# Altium schematic sheet 08-Power.SchDoc
size B; SheetNumber: 8; SheetTotal: 11
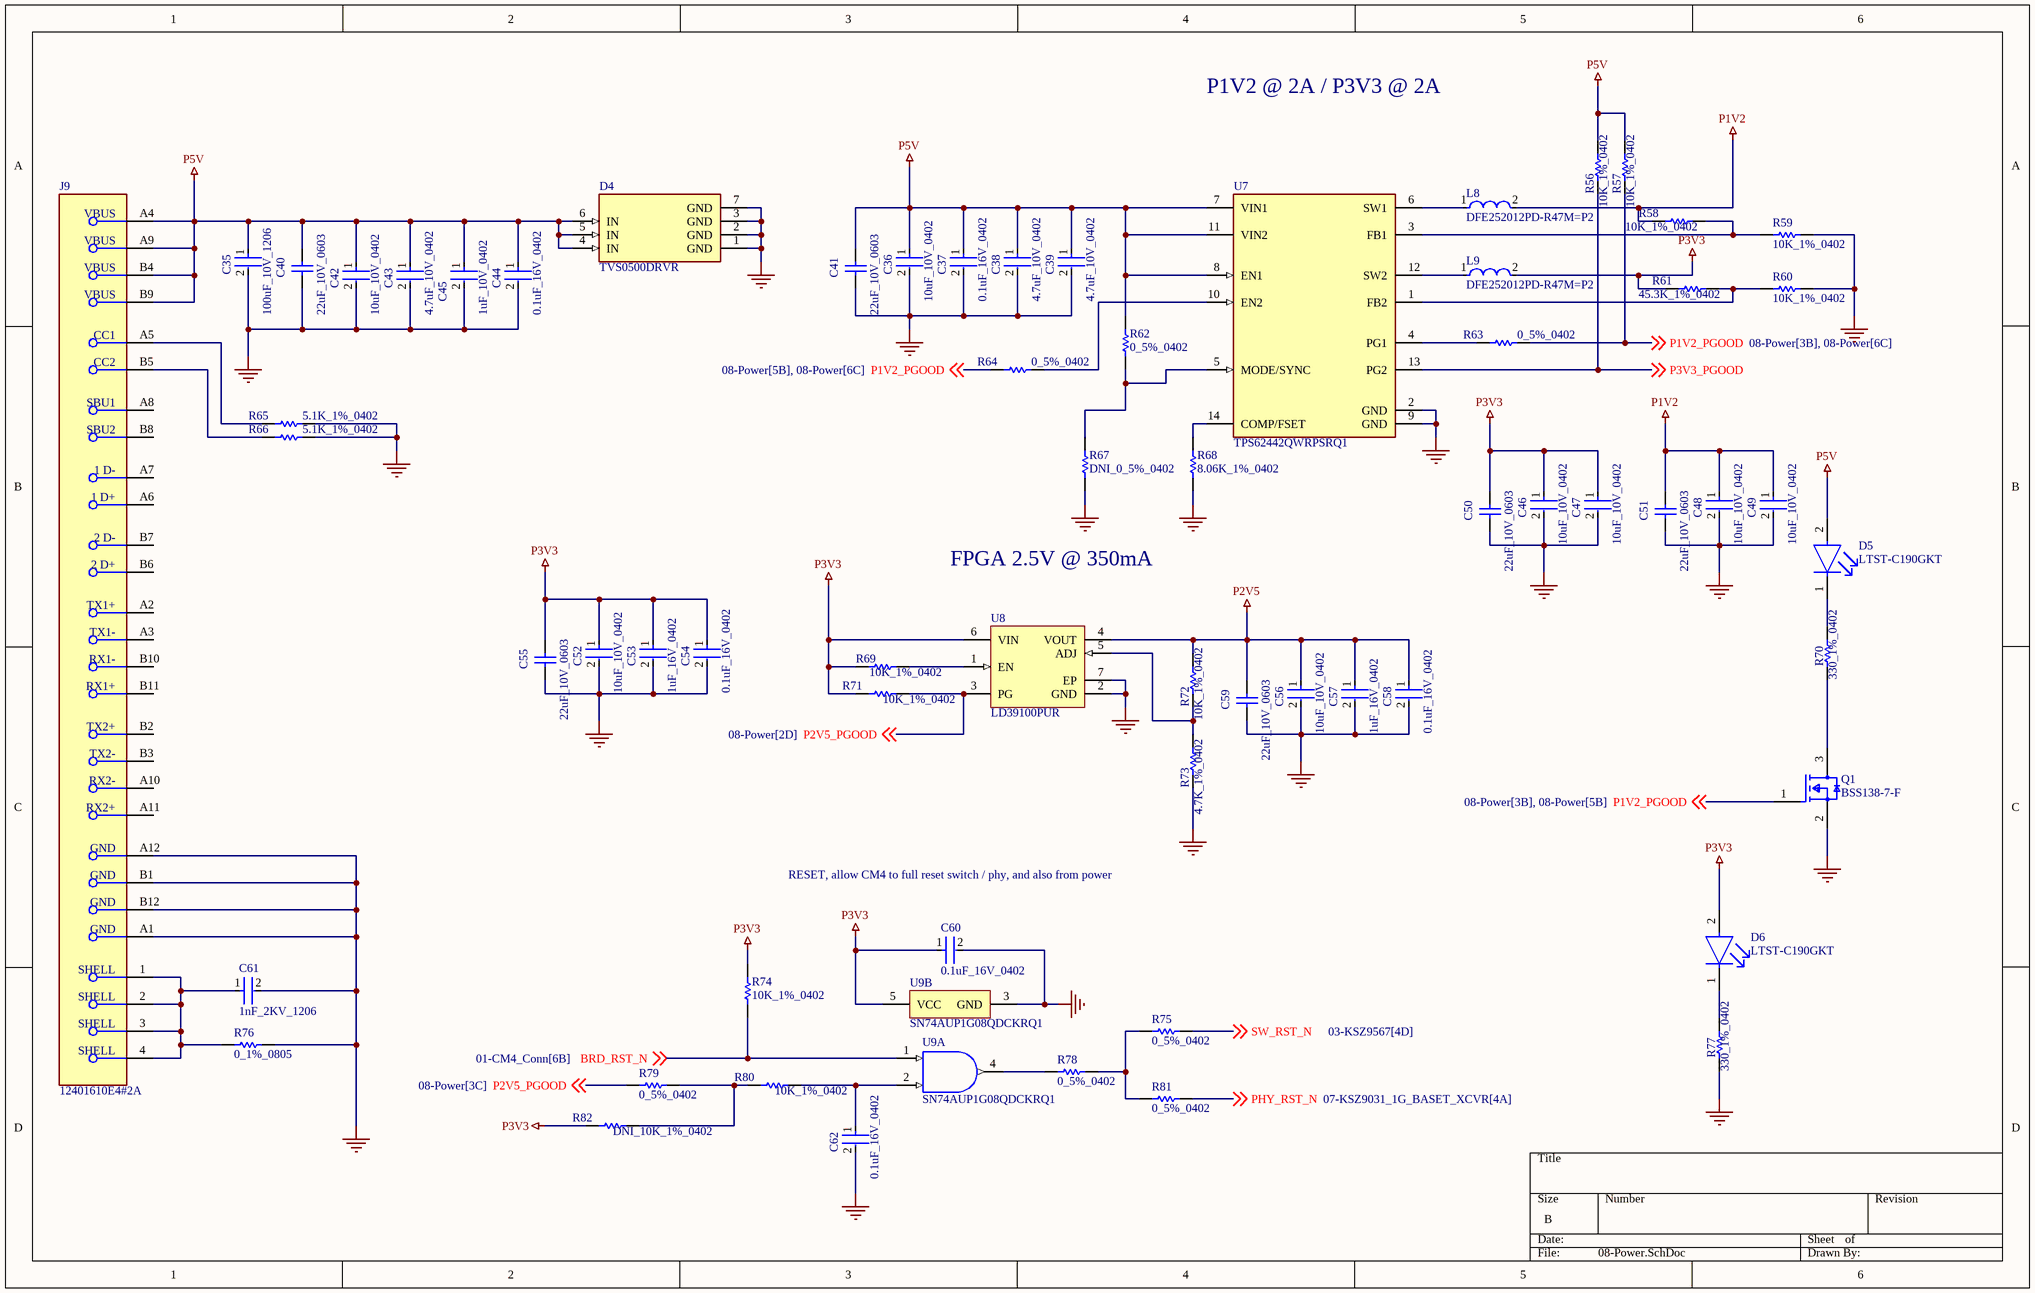
[diagram p0: 08-Power.SchDoc]

## Parts
C35  100uF_10V_1206  [FP-C3216-160-0_3-IPC_C]
C36  10uF_10V_0402  [FP-CL05A106MP5NUNC-MFG]
C37  0.1uF_16V_0402  [FP-C0402-BB-MFG]
C38  4.7uF_10V_0402  [FP-C1005-050-0_15-MFG]
C39  4.7uF_10V_0402  [FP-C1005-050-0_15-MFG]
C40  22uF_10V_0603  [CAPC1608X100X20ML10]
C41  22uF_10V_0603  [CAPC1608X100X20ML10]
C42  10uF_10V_0402  [FP-CL05A106MP5NUNC-MFG]
C43  4.7uF_10V_0402  [FP-C1005-050-0_15-MFG]
C44  0.1uF_16V_0402  [FP-C0402-BB-MFG]
C45  1uF_10V_0402  [FP-CL511-IPC_C]
C46  10uF_10V_0402  [FP-CL05A106MP5NUNC-MFG]
C47  10uF_10V_0402  [FP-CL05A106MP5NUNC-MFG]
C48  10uF_10V_0402  [FP-CL05A106MP5NUNC-MFG]
C49  10uF_10V_0402  [FP-CL05A106MP5NUNC-MFG]
C50  22uF_10V_0603  [CAPC1608X100X20ML10]
C51  22uF_10V_0603  [CAPC1608X100X20ML10]
C52  10uF_10V_0402  [FP-CL05A106MP5NUNC-MFG]
C53  1uF_16V_0402  [FP-0402-L_1_0_0_05-W_0_5-IPC_A]
C54  0.1uF_16V_0402  [FP-C0402-BB-MFG]
C55  22uF_10V_0603  [CAPC1608X100X20ML10]
C56  10uF_10V_0402  [FP-CL05A106MP5NUNC-MFG]
C57  1uF_16V_0402  [FP-0402-L_1_0_0_05-W_0_5-IPC_A]
C58  0.1uF_16V_0402  [FP-C0402-BB-MFG]
C59  22uF_10V_0603  [CAPC1608X100X20ML10]
C60  0.1uF_16V_0402  [FP-C0402-BB-MFG]
C61  1nF_2KV_1206  [FP-CC1206-0_3-1_45-IPC_C]
C62  0.1uF_16V_0402  [FP-C0402-BB-MFG]
D4  TVS0500DRVR  [FP-DRV0006A-MFG]
D5  LTST-C190GKT  [FP-LTST-C190GKT-MFG]
D6  LTST-C190GKT  [FP-LTST-C190GKT-MFG]
J9  12401610E4#2A  [FP-12401610E4#2A-MFG]
L8  DFE252012PD-R47M=P2  [FP-DFE252012C-IPC_A]
L9  DFE252012PD-R47M=P2  [FP-DFE252012C-IPC_A]
Q1  BSS138-7-F  [FP-SOT23_Standard-MFG]
R56  10K_1%_0402  [RESC1005X40X25NL10T10]
R57  10K_1%_0402  [RESC1005X40X25NL10T10]
R58  10K_1%_0402  [RESC1005X40X25NL10T10]
R59  10K_1%_0402  [RESC1005X40X25NL10T10]
R60  10K_1%_0402  [RESC1005X40X25NL10T10]
R61  45.3K_1%_0402  [RESC0402(1005)_L]
R62  0_5%_0402  [RESC1005X40X25NL05T10]
R63  0_5%_0402  [RESC1005X40X25NL05T10]
R64  0_5%_0402  [RESC1005X40X25NL05T10]
R65  5.1K_1%_0402  [RESC1005X40X25NL05T10]
R66  5.1K_1%_0402  [RESC1005X40X25NL05T10]
R67  DNI_0_5%_0402  [RESC1005X40X25NL05T10]  (no BOM)
R68  8.06K_1%_0402  [RESC1005X40X25ML05T05]
R69  10K_1%_0402  [RESC1005X40X25NL10T10]
R70  330_1%_0402  [RESC1005X40X25NL10T10]
R71  10K_1%_0402  [RESC1005X40X25NL10T10]
R72  10K_1%_0402  [RESC1005X40X25NL10T10]
R73  4.7K_1%_0402  [RESC1005X40X25NL10T10]
R74  10K_1%_0402  [RESC1005X40X25NL10T10]
R75  0_5%_0402  [RESC1005X40X25NL05T10]
R76  0_1%_0805  [RESC2013X60X35NL10T20]
R77  330_1%_0402  [RESC1005X40X25NL10T10]
R78  0_5%_0402  [RESC1005X40X25NL05T10]
R79  0_5%_0402  [RESC1005X40X25NL05T10]
R80  10K_1%_0402  [RESC1005X40X25NL10T10]
R81  0_5%_0402  [RESC1005X40X25NL05T10]
R82  DNI_10K_1%_0402  [RESC1005X40X25NL10T10]  (no BOM)
U7  TPS62442QWRPSRQ1  [FP-RQR0014A-MFG]
U8  LD39100PUR  [DFN6D_M]
U9  SN74AUP1G08QDCKRQ1  [DCK0005A_L]  (parts A,B of 2)

## Nets
GND: C35.2 C36.2 C37.2 C38.2 C39.2 C40.1 C41.1 C42.2 C43.2 C44.2 C45.2 C46.2 C47.2 C48.2 C49.2 C50.1 C51.1 C52.2 C53.2 C54.2 C55.1 C56.2 C57.2 C58.2 C59.1 C60.2 C61.2 C62.2 D4.1(GND) D4.2(GND) D4.3(GND) D4.7(GND) J9.A1(GND) J9.A12(GND) J9.B1(GND) J9.B12(GND) Q1.2(S) R59.1 R60.1 R65.2 R66.2 R67.1 R68.1 R73.1 R76.2 R77.1 U7.2(GND) U7.9(GND) U8.2(GND) U8.7(EP) U9.3(GND)
P1V2: C48.1 C49.1 C51.2 L8.2 R58.2
P2V5: C56.1 C57.1 C58.1 C59.2 R72.2 U8.4(VOUT)
P3V3: C46.1 C47.1 C50.2 C52.1 C53.1 C54.1 C55.2 C60.1 D6.2(A) L9.2 R61.1 R69.2 R71.2 R74.1 R82.2 U8.6(VIN) U9.5(VCC)
P5V: C35.1 C36.1 C37.1 C38.1 C39.1 C40.2 C41.2 C42.1 C43.1 C44.1 C45.1 D4.4(IN) D4.5(IN) D4.6(IN) D5.2(A) J9.A4(VBUS) J9.A9(VBUS) J9.B4(VBUS) J9.B9(VBUS) R56.2 R57.2 R62.2 U7.7(VIN1) U7.8(EN1) U7.11(VIN2)
BRD_RST_N: R74.2 U9.1(A) ; off-sheet BRD_RST_N
P1V2_PGOOD: Q1.1(G) R57.1 R63.2 R64.1 ; off-sheet P1V2_PGOOD
P2V5_PGOOD: R71.1 R79.2 U8.3(PG) ; off-sheet P2V5_PGOOD
P3V3_PGOOD: R56.1 U7.13(PG2) ; off-sheet P3V3_PGOOD
PHY_RST_N: R81.1 ; off-sheet PHY_RST_N
SW_RST_N: R75.1 ; off-sheet SW_RST_N
NetC61_1: C61.1 J9.1(SHELL) J9.2(SHELL) J9.3(SHELL) J9.4(SHELL) R76.1
NetC62_1: C62.1 R80.1 U9.2(B)
NetD5_1: D5.1(C) R70.2
NetD6_1: D6.1(C) R77.2
NetJ9_A5: J9.A5(CC1) R65.1
NetJ9_B5: J9.B5(CC2) R66.1
NetL8_1: L8.1 U7.6(SW1)
NetL9_1: L9.1 U7.12(SW2)
NetQ1_3: Q1.3(D) R70.1
NetR58_1: R58.1 R59.2 U7.3(FB1)
NetR60_2: R60.2 R61.2 U7.1(FB2)
NetR62_1: R62.1 R67.2 U7.5(MODE/SYNC)
NetR63_1: R63.1 U7.4(PG1)
NetR64_2: R64.2 U7.10(EN2)
NetR68_2: R68.2 U7.14(COMP/FSET)
NetR69_1: R69.1 U8.1(EN)
NetR72_1: R72.1 R73.2 U8.5(ADJ)
NetR75_2: R75.2 R78.1 R81.2
NetR78_2: R78.2 U9.4(Y)
NetR79_1: R79.1 R80.2 R82.1

Not connected (* = marked no-connect by the designer): J9 A2(TX1+) A3(TX1-) A6(1_D+) A7(1_D-) A8(SBU1) A10(RX2-) A11(RX2+) B2(TX2+) B3(TX2-) B6(2_D+) B7(2_D-) B8(SBU2) B10(RX1-) B11(RX1+)

## Notes on the sheet
- P1V2 @ 2A / P3V3 @ 2A
- FPGA 2.5V @ 350mA
- RESET, allow CM4 to full reset switch / phy, and also from power

## Library data of the parts
C35 = CMP-2000-05396-3: Multilayer Ceramic Capacitors 100uF ±20% 10V X5R SMD 1206; Voltage Rating (DC): 10V; Length: 3.2mm; Mount: Surface Mount; Depth: 1.6mm; Width: 1.6mm; Package Quantity: 1; Min Operating Temperature: -55°C; Packaging: Tape and Reel; Max Operating Temperature: 85°C; Dielectric: X5R; Construction: Flat; Case Code (Imperial): 1206; Capacitance: 100uF; Thickness: 0.075inch; Radiation Hardening: No; RoHS Compliant: Yes; Series: C; Dielectric Material: Ceramic; Voltage: 10V; REACH SVHC: No SVHC; Case Code (Metric): 3216; Weight: 0.000571oz; Height: 1.6mm; Voltage Rating: 10V; Termination: SMD/SMT; Lead Free: Lead Free; Tolerance: 20%; Case/Package: 1206; Resistor Type: Ceramic
C36 C42 C46-C49 C52 C56 = CMP-13271-000002-1: CAP CER 10UF 10V X5R 0402; Manufacturer Part Number: CL05A106MP5NUNC; Manufacturer: Samsung; Temperature Coefficient: 15%; Tolerance: 20%; Material: Ceramic; Octopart: https://octopart.com/cl05a106mp5nunc-samsung-22457395; Voltage Rating: 10V; RoHS: TRUE; Value: 10uF; Height: 0.7mm; Digikey Description: CAP CER 10UF 10V X5R 0402; Automotive: No; Package: CL05A106MP5NUNC; Device Class L1: Passive Components; Capacitance: 10uF; Temperature Range High: +85°C; ComponentLink2Description: Datasheet; Device Class L2: Capacitors; Temperature Characteristic: X5R; Temperature: -55°C to +85°C; ComponentLink2URL: http://www.samsungsem.com/kr/support/product-search/mlcc/__icsFiles/afieldfile/2019/05/10/19-CL05A106MP5NUNC.pdf; Device Class L3: Ceramic Capacitors; Category: Cap; Temperature Range Low: -55°C; Ipc Land Pattern Name: CAPC10050X50; Lead Free: Yes
C37 C44 C54 C58 C60 C62 = CMP-1034-02068-3: CAP CER 0.1UF 16V 5% X7R 0402; Manufacturer: Kemet; Manufacturer Part Number: C0402C104J4RACTU; Value: 0.10 μF; Temperature Coefficient: 15%; Tolerance: 0.05; Material: Ceramic; ComponentLink2URL: https://content.kemet.com/datasheets/KEM_C1002_X7R_SMD.pdf; Automotive: No; Device Class L2: Capacitors; Temperature: -55°C to +125°C; RoHS: TRUE; Voltage Rating: 16 V; ComponentLink2Description: Datasheet; Device Class L3: Ceramic Capacitors; Temperature Range Low: -55°C; Ipc Land Pattern Name: CAPC10050X50; Device Class L1: Passive Components; Temperature Range High: +125°C; Package: C0402-BB; Capacitance: 0.10 μF; Category: Cap; Mouser Description: CAP CER 0.1UF 16V X7R 0402; Height: 0.55mm; Digikey Description: CAP CER 0.1UF 16V 5% X7R 0402; Octopart: https://octopart.com/c0402c104j4ractu-kemet-12573893; Temperature Characteristic: X7R; Lead Free: Yes
C38 C39 C43 = CMP-2000-05997-2: CAP CER 4.7UF 10V X5R 0402; Dielectric Material: Ceramic; Tolerance: 10%; Series: C; Package Quantity: 10000; Max Operating Temperature: 85°C; Case Code (Imperial): 0402; Lead Free: Lead Free; Voltage Rating (DC): 10V; Packaging: Cut Tape; Voltage Rating: 10V; Min Operating Temperature: -55°C; Dielectric: X5R; Thickness: 0.022inch; Width: 0.02inch; Case/Package: 0402; Case Code (Metric): 1005; Capacitance: 4.7uF; Length: 0.039inch; RoHS Compliant: Yes; REACH SVHC: No SVHC; Mount: Surface Mount
C40 C41 C50 C51 C55 C59 = CMP-2000-05441-1: Chip Capacitor, 22 uF, +/- 20%, 10 V, -55 to 85 degC, 0603 (1608 Metric), RoHS, Tape and Reel; Manufacturer: TDK; PCN Part Number: MLCCPartNumberChange30/Nov/2012; Voltage - Rated: 10V; Product Training Modules: CSeriesGeneralApplicationsSEAT,CCV,andTVCLDesignToolsGuidetoReplacinganElectrolyticCapacitorwithanMLCC; Other Names: 445-9077-1; Design Resources: 20WNon-IsolatedBuckLEDDriverUsingPLLNK460KG; Online Catalog: CSeries,GeneralPurpose; Capacitance: 22µF; Temperature Coefficient: X5R; Kits: 445-9014-KIT-ND-KITMLCC100PF-22UF060310-50V; Packaging: CutTape(CT); Standard Package: 1; Package / Case: 0603(1608Metric); Lead Style: -; Features: -; Ratings: -; Operating Temperature: -55degC~85degC; Applications: GeneralPurpose; Package Reference: 603; Datasheet URL: http://download.siliconexpert.com/pdfs/2015/4/21/15/54/45/779/tdk_/manual/37024850441143360mlcc_commercial_general_en.pdf; Datasheet Version: Mar-15; Mounting Type: SurfaceMount,MLCC; Lead Spacing: -; Size / Dimension: 0.063"Lx0.031"W(1.60mmx0.80mm); Height - Seated (Max): -; Package Description: 2-Pin Surface Mount Device, Body 1.6 x 0.8 mm; Manufacturer URL: http://www.tdk.com/; RoHS Information: RoHSCertificate-MLCC; Tolerance: ±20%; Series: C; Thickness (Max): 0.035"(0.90mm); Family: CeramicCapacitors; Category: Capacitors
C45 = CMP-13271-001936-1: Cap Ceramic 1uF 10V X5R ±10% SMD 0402 +85°C Paper T/R; Depth: 0.5mm; Case Code (Imperial): 0402; Material: Ceramic; Mount: Surface Mount; Thickness: 0.022inch; Dielectric: X5R; Capacitance: 1uF; Radiation Hardening: No; Case/Package: 0402; Length: 1mm; Tolerance: 10%; Max Operating Temperature: 85°C; Package Quantity: 1; Width: 0.02inch; Voltage Rating: 10V; Contact Plating: Tin; Height: 0.5mm; Min Operating Temperature: -55°C; Case Code (Metric): 1005; Packaging: Tape and Reel
C53 C57 = CMP-14477-000104-2: None; Tolerance: 10%; Voltage Rating: 16V; Dielectric: X5R; Capacitance: 1uF; Packaging: Tape and Reel; Depth: 0.5mm; Mount: Surface Mount; Thickness: 0.022inch; Package Quantity: 1; Min Operating Temperature: -55°C; Series: M; Voltage Rating (DC): 16V; Termination: SMD/SMT; Case/Package: 0402; Number of Pins: 2; Case Code (Imperial): 0402; Length: 1mm; Halogen Free: Halogen Free; Case Code (Metric): 1005; Width: 0.02inch; RoHS Compliant: Yes; Radiation Hardening: No; Max Operating Temperature: 85°C; Height: 0.5mm; Construction: Flat
C61 = CMP-2000-05436-2: CAP CER 1000PF 2KV X7R 1206; Capacitance: 1nF; Insulation Resistance: 10GR; Dissipation Factor: 2.5%; Tolerance: 10%; Termination: SMD/SMT; Voltage Rating (DC): 2kV; Case/Package: 1206; Length: 3.2mm; Depth: 1.6mm; Case Code (Imperial): 1206; Package Quantity: 1; Packaging: Tape and Reel; Dielectric: X7R; Mount: Surface Mount; Max Operating Temperature: 125°C; Lead Free: Lead Free; Number of Pins: 2; Thickness: 0.057inch; Width: 0.063inch; Resistor Type: Ceramic; Series: CC; RoHS Compliant: Yes; Voltage Rating: 2kV; Radiation Hardening: No; Construction: Flat; Height: 1.25mm; Min Operating Temperature: -55°C; Voltage: 2kV; Case Code (Metric): 3216
D4 = CMP-04989-000008-1: UNIDIR PRECISION SURGE DIODE; Peak Pulse Power: 400W; Power Line Protection: No; Reverse Standoff Voltage: 5V; Min Breakdown Voltage: 7.5V; Peak Pulse Current: 43A; Number of Unidirectional Channels: 1; Clamping Voltage: 9.5V; Packaging: Tape and Reel; Max Operating Temperature: 125°C; RoHS Compliant: Yes; Min Operating Temperature: -40°C; Mount: Surface Mount; Resistor Type: Zener; Number of Channels: 1
D5 D6 = CMP-22017-000005-2: LED GREEN CLEAR CHIP SMD; Dominant Wavelength: 569nm; Reverse Voltage: 5V; Lens Color: Colorless; Viewing Angle: 130°; Voltage: 2V; Forward Current: 30mA; Power Dissipation: 100mW; Luminous Intensity: 6mcd; Number of LEDs: 1; Forward Voltage: 2.1V; Wavelength: 565nm; Test Current: 10mA; Min Operating Temperature: -55°C; Lens Style: Clear; Mount: Surface Mount; Width: 0.8mm; Packaging: Tape and Reel; Lens Transparency: Clear; Case Code (Metric): 1608; Depth: 0.8mm; Case Code (Imperial): 0603; Case/Package: 0603; Number of Pins: 2; Max Operating Temperature: 85°C; Lead Free: Lead Free; Number of Elements: 1; Length: 1.6mm; Height: 0.8mm; Package Quantity: 1; Power Rating: 100mW; Radiation Hardening: No; Illumination Color: Green; Color: Green
J9 = CMP-02355-000003-1: CONN RCP USB3.1 TYPEC 24P SMD RA; Connector Type: USB; Number of Contacts: 24; Gender: Receptacle; Packaging: Cut Tape; Mount: Surface Mount; Number of Pins: 24
L8 L9 = CMP-06042-015149-1: Shielded Wirewound Inductor 0.47uH 20% 4000mA 0.027Ω 1008 (2520)
Q1 = CMP-2000-04930-2: NexarPartId: 335900; Voltage: 50V; Fall Time: 25ns; Number of Elements: 1; Turn-On Delay Time: 20ns; Drain to Source Resistance: 1.4Ω; Element Configuration: Single; Max Power Dissipation: 300mW; Current Rating: 200mA; Max Junction Temperature (Tj): 150°C; Input Capacitance: 50pF; Threshold Voltage: 1.2V; Current: 2A; Rds On Max: 3.5Ω; Rise Time: 10ns; Gate to Source Voltage (Vgs): 20V; Number of Pins: 3; Width: 1.3mm; Case/Package: SOT-23; Lead Free: Lead Free; Height: 1.15mm; Packaging: Cut Tape; Length: 2.9mm; REACH SVHC: No SVHC; Weight: 7.994566mg; Voltage Rating (DC): 50V; Contact Plating: Tin; Power Dissipation: 300mW; Mount: Surface Mount; Min Operating Temperature: -55°C; RoHS: Compliant; Max Operating Temperature: 150°C; Schedule B: 8541210080, 8541210080; Drain to Source Breakdown Voltage: 50V; Continuous Drain Current (ID): 200mA; Resistance: 3.5Ω; Number of Channels: 1; Drain to Source Voltage (Vdss): 50V; Turn-Off Delay Time: 20ns; Nominal Vgs: 1.2V
R56-R60 R69 R71 R72 R74 R80 R82 = CMP-2002-04694-1: Manufacturer: Bourns; Part Number: CR0402-FX-1002GLF
R61 = CMP-1011-00697-1: 45K3 0.063W 1% 0402 (1005 Metric)  SMD; Case-EIA: 0402; Case-Metric: 1005; Value: 45300.00 Ohm; Technology: SMT; Tolerance: 1 %; Power: 0.063 W
R62-R64 R67 R75 R78 R79 R81 = CMP-2002-06457-1: Manufacturer: Panasonic; Part Number: ERJ-U020R00X
R65 R66 = CMP-2002-07753-1: Part Number: RC0402FR-075K1L; Manufacturer: Yageo / Phycomp
R68 = CMP-2002-00253-3: Chip Resistor, 8.06 KOhm, +/- 1%, 63 mW, -55 to 155 degC, 0402 (1005 Metric), RoHS, Tape and Reel; PartNumber: CRCW04028K06FKED; Manufacturer: Basic Passives; Case\/Package: 0402; Power Rating: 63 mW; Voltage Rating: 50 V; PackageReference: 0402; Radiation Hardening: No; Package Quantity: 10000; Height: 0.35 mm; Packaging: Tape and Reel; Mount: Surface Mount; Length: 1 mm; Weight: 2.3E-05oz; Case Code (Metric): 1005; DatasheetVersion: 06/2012; Pins: 2; Min Operating Temperature: -55 degC; Case Code (Imperial): 0402; REACH SVHC: Unknown; Tolerance: 1%; Mounting Technology: Surface Mount; ComponentLink1URL: http://www.vishay.com/; ComponentLink2URL: http://www.vishay.com/docs/20035/dcrcwe3.pdf; ComponentLink2Description: Datasheet; Resistance: 8.06 KOhm; Max Operating Temperature: 155 degC; ComponentLink1Description: Manufacturer URL; Width: 0.5 mm; RoHSCompliant: true; PackageDescription: 2-Pin Surface Mount Device, Body 1 x 0.5 mm
R70 R77 = CMP-2002-05853-1: Manufacturer: Panasonic; Part Number: ERA-2AED331X
R73 = CMP-2002-05217-1: Manufacturer: Bourns; Part Number: CR0402-FX-4701GLF
R76 = CMP-2001-04478-1: Manufacturer: Yageo; Part Number: AC0805FR-070RL
U7 = CMP-04918-000654-1: Adjustable-Frequency Dual Step-Down Converter, 2.7-6V VIN, 0.6-5.5V 2A VOUT, VQFN-HR14
U8 = CMP-0244-00287-1: 1 A Low Quiescent Current Low Noise Voltage Regulator, Adjustable from 0.8V, 6-Pin VFDFPN, Tape and Reel; ComponentLink1URL: http://www.st.com; ComponentLink1Description: Manufacturer URL; ComponentLink2Description: Datasheet; DatasheetVersion: 1/10/2011; PackageDescription: 6-Pin Plastic, Dual LLP, 3 x 3 mm Body, 0.95 mm Pitch, Exposed Pad; PackageReference: DFN6D; ComponentLink2URL: http://www.st.com/internet/com/TECHNICAL_RESOURCES/TECHNICAL_LITERATURE/DATASHEET/CD00233788.pdf; PackageVersion: 2008
U9 = CMP-0859-00286-3: Automotive Catalog Low-Power Single 2-Input Positive-AND Gate, DCK0005A, LARGE T&R; Manufacturer: Texas Instruments; Generic Part Number: SN74AUP1G08-Q1; VCC(Min)(V): 0.8; Voltage(Nom)(V): 0.8,1.2,1.5,1.8,2.5,3.3; Input Type: CMOS; F @ Nom Voltage(Max)(Mhz): 100; tpd @ Nom Voltage(Max)(ns): 32.8,20.9,14.2,11,7.6,6.2; Gate Type: AND; Technology Family: AUP; VCC(Max)(V): 3.6; ICC @ Nom Voltage(Max)(mA): 0.0009; Output Drive (IOL/IOH)(Max)(mA): 20/-20; Schmitt Trigger: No; Bits(#): 1; Logic: True; Sub-Family: AND Gate; DatasheetVersion: SCES847; Rating: Automotive; Output Type: CMOS; Operating Temperature Range(C): -40 to 125; PackageReference: DCK0005A; 3-State Output: No